# Altium schematic sheet Operations_Architecture.SchDoc
size Tabloid; SheetNumber: 5; SheetTotal: 13
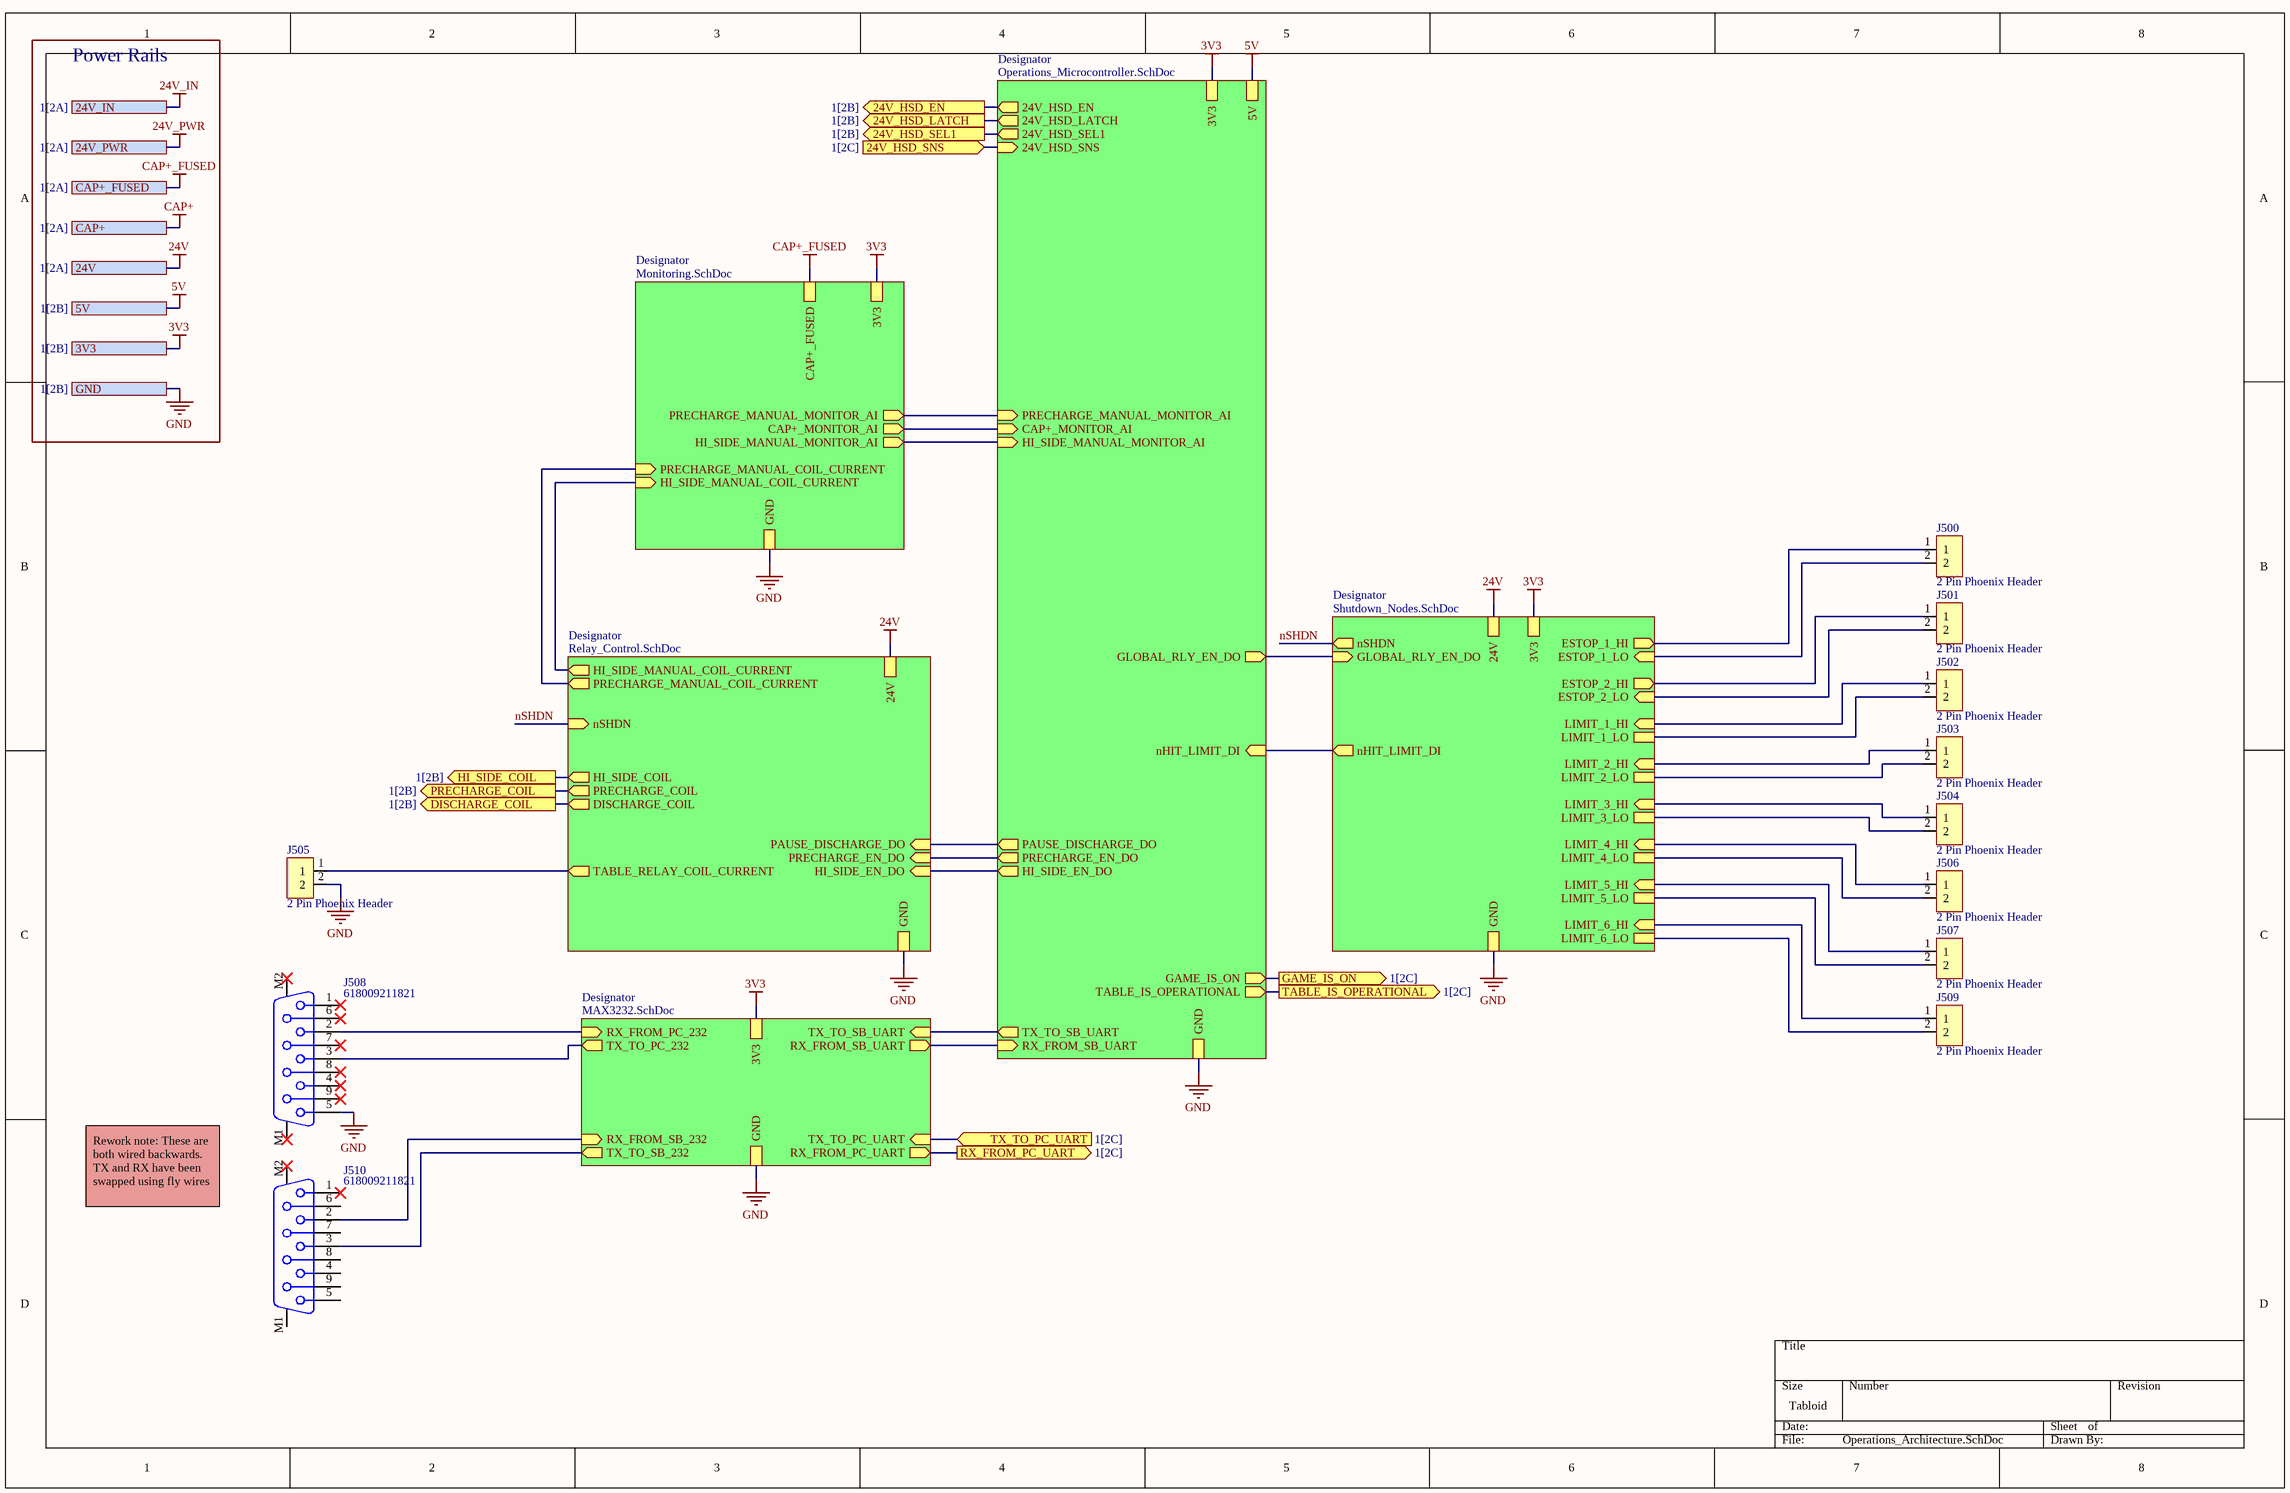
[diagram p0: Operations_Architecture.SchDoc]

## Parts
J500  2 Pin Phoenix Header  [2 Pin Phoenix Header]
J501  2 Pin Phoenix Header  [2 Pin Phoenix Header]
J502  2 Pin Phoenix Header  [2 Pin Phoenix Header]
J503  2 Pin Phoenix Header  [2 Pin Phoenix Header]
J504  2 Pin Phoenix Header  [2 Pin Phoenix Header]
J505  2 Pin Phoenix Header  [2 Pin Phoenix Header]
J506  2 Pin Phoenix Header  [2 Pin Phoenix Header]
J507  2 Pin Phoenix Header  [2 Pin Phoenix Header]
J508  618009211821  [618009211821]
J509  2 Pin Phoenix Header  [2 Pin Phoenix Header]
J510  618009211821  [618009211821]

## Sub-sheets
Designator = Relay_Control.SchDoc: nSHDN (in), TABLE_RELAY_COIL_CURRENT (out), 24V, GND, PRECHARGE_MANUAL_COIL_CURRENT (out), HI_SIDE_MANUAL_COIL_CURRENT (out), PAUSE_DISCHARGE_DO (in), PRECHARGE_EN_DO (in), HI_SIDE_EN_DO (in), DISCHARGE_COIL (out), HI_SIDE_COIL (out), PRECHARGE_COIL (out)
Designator = Monitoring.SchDoc: CAP+_MONITOR_AI (out), HI_SIDE_MANUAL_MONITOR_AI (out), PRECHARGE_MANUAL_MONITOR_AI (out), HI_SIDE_MANUAL_COIL_CURRENT (in), PRECHARGE_MANUAL_COIL_CURRENT (in), 3V3, GND, CAP+_FUSED
Designator = Shutdown_Nodes.SchDoc: ESTOP_1_HI (out), ESTOP_1_LO (in), ESTOP_2_HI (out), ESTOP_2_LO (in), nSHDN (out), LIMIT_1_HI (in), LIMIT_1_LO, LIMIT_2_HI (in), LIMIT_2_LO, LIMIT_3_HI (in), LIMIT_3_LO, LIMIT_4_HI (in), LIMIT_4_LO, LIMIT_5_HI (in), LIMIT_5_LO, LIMIT_6_HI (in), LIMIT_6_LO, nHIT_LIMIT_DI (out), GLOBAL_RLY_EN_DO (in), 24V, GND, 3V3
Designator = Operations_Microcontroller.SchDoc: PAUSE_DISCHARGE_DO (out), PRECHARGE_EN_DO (out), HI_SIDE_EN_DO (out), GLOBAL_RLY_EN_DO (out), nHIT_LIMIT_DI (in), TX_TO_SB_UART (out), RX_FROM_SB_UART (in), CAP+_MONITOR_AI (in), HI_SIDE_MANUAL_MONITOR_AI (in), PRECHARGE_MANUAL_MONITOR_AI (in), GAME_IS_ON (out), TABLE_IS_OPERATIONAL (out), 3V3, GND, 24V_HSD_EN (out), 24V_HSD_LATCH (out), 24V_HSD_SEL1 (out), 24V_HSD_SNS (in), 5V
Designator = MAX3232.SchDoc: TX_TO_PC_232 (out), RX_FROM_PC_232 (in), TX_TO_SB_232 (out), RX_FROM_SB_232 (in), 3V3, GND, TX_TO_SB_UART (in), RX_FROM_SB_UART (out), TX_TO_PC_UART (in), RX_FROM_PC_UART (out)

## Ports
3V3 (see 1[2B]), 5V (see 1[2B]), 24V (see 1[2A]), 24V_HSD_EN (out, see 1[2B]), 24V_HSD_LATCH (out, see 1[2B]), 24V_HSD_SEL1 (out, see 1[2B]), 24V_HSD_SNS (in, see 1[2C]), 24V_IN (see 1[2A]), 24V_PWR (see 1[2A]), CAP+ (see 1[2A]), CAP+_FUSED (see 1[2A]), DISCHARGE_COIL (out, see 1[2B]), GAME_IS_ON (out, see 1[2C]), GND (see 1[2B]), HI_SIDE_COIL (out, see 1[2B]), PRECHARGE_COIL (out, see 1[2B]), RX_FROM_PC_UART (out, see 1[2C]), TABLE_IS_OPERATIONAL (out, see 1[2C]), TX_TO_PC_UART (in, see 1[2C])

## Nets
3V3: port 3V3, sheet Designator/3V3, sheet Designator/3V3, sheet Designator/3V3, sheet Designator/3V3
5V: port 5V, sheet Designator/5V
24V: port 24V, sheet Designator/24V, sheet Designator/24V
24V_IN: port 24V_IN
24V_PWR: port 24V_PWR
CAP+: port CAP+
CAP+_FUSED: port CAP+_FUSED, sheet Designator/CAP+_FUSED
GND: J505.2 J508.5 ; port GND, sheet Designator/GND, sheet Designator/GND, sheet Designator/GND, sheet Designator/GND, sheet Designator/GND
24V_HSD_EN: port 24V_HSD_EN, sheet Designator/24V_HSD_EN
24V_HSD_LATCH: port 24V_HSD_LATCH, sheet Designator/24V_HSD_LATCH
24V_HSD_SEL1: port 24V_HSD_SEL1, sheet Designator/24V_HSD_SEL1
24V_HSD_SNS: port 24V_HSD_SNS, sheet Designator/24V_HSD_SNS
DISCHARGE_COIL: port DISCHARGE_COIL, sheet Designator/DISCHARGE_COIL
GAME_IS_ON: port GAME_IS_ON, sheet Designator/GAME_IS_ON
HI_SIDE_COIL: port HI_SIDE_COIL, sheet Designator/HI_SIDE_COIL
nSHDN: sheet Designator/nSHDN, sheet Designator/nSHDN
PRECHARGE_COIL: port PRECHARGE_COIL, sheet Designator/PRECHARGE_COIL
RX_FROM_PC_UART: port RX_FROM_PC_UART, sheet Designator/RX_FROM_PC_UART
TABLE_IS_OPERATIONAL: port TABLE_IS_OPERATIONAL, sheet Designator/TABLE_IS_OPERATIONAL
TX_TO_PC_UART: port TX_TO_PC_UART, sheet Designator/TX_TO_PC_UART
NetJ500_1: J500.1 ; sheet Designator/ESTOP_1_HI
NetJ500_2: J500.2 ; sheet Designator/ESTOP_1_LO
NetJ501_1: J501.1 ; sheet Designator/ESTOP_2_HI
NetJ501_2: J501.2 ; sheet Designator/ESTOP_2_LO
NetJ502_1: J502.1 ; sheet Designator/LIMIT_1_HI
NetJ502_2: J502.2 ; sheet Designator/LIMIT_1_LO
NetJ503_1: J503.1 ; sheet Designator/LIMIT_2_HI
NetJ503_2: J503.2 ; sheet Designator/LIMIT_2_LO
NetJ504_1: J504.1 ; sheet Designator/LIMIT_3_HI
NetJ504_2: J504.2 ; sheet Designator/LIMIT_3_LO
NetJ505_1: J505.1 ; sheet Designator/TABLE_RELAY_COIL_CURRENT
NetJ506_1: J506.1 ; sheet Designator/LIMIT_4_HI
NetJ506_2: J506.2 ; sheet Designator/LIMIT_4_LO
NetJ507_1: J507.1 ; sheet Designator/LIMIT_5_HI
NetJ507_2: J507.2 ; sheet Designator/LIMIT_5_LO
NetJ508_2: J508.2 ; sheet Designator/RX_FROM_PC_232
NetJ508_3: J508.3 ; sheet Designator/TX_TO_PC_232
NetJ509_1: J509.1 ; sheet Designator/LIMIT_6_HI
NetJ509_2: J509.2 ; sheet Designator/LIMIT_6_LO
NetJ510_2: J510.2 ; sheet Designator/RX_FROM_SB_232
NetJ510_3: J510.3 ; sheet Designator/TX_TO_SB_232
(unnamed): sheet Designator/PRECHARGE_MANUAL_COIL_CURRENT, sheet Designator/PRECHARGE_MANUAL_COIL_CURRENT
(unnamed): sheet Designator/HI_SIDE_MANUAL_COIL_CURRENT, sheet Designator/HI_SIDE_MANUAL_COIL_CURRENT
(unnamed): sheet Designator/PAUSE_DISCHARGE_DO, sheet Designator/PAUSE_DISCHARGE_DO
(unnamed): sheet Designator/PRECHARGE_EN_DO, sheet Designator/PRECHARGE_EN_DO
(unnamed): sheet Designator/HI_SIDE_EN_DO, sheet Designator/HI_SIDE_EN_DO
(unnamed): sheet Designator/CAP+_MONITOR_AI, sheet Designator/CAP+_MONITOR_AI
(unnamed): sheet Designator/HI_SIDE_MANUAL_MONITOR_AI, sheet Designator/HI_SIDE_MANUAL_MONITOR_AI
(unnamed): sheet Designator/PRECHARGE_MANUAL_MONITOR_AI, sheet Designator/PRECHARGE_MANUAL_MONITOR_AI
(unnamed): sheet Designator/nHIT_LIMIT_DI, sheet Designator/nHIT_LIMIT_DI
(unnamed): sheet Designator/GLOBAL_RLY_EN_DO, sheet Designator/GLOBAL_RLY_EN_DO
(unnamed): sheet Designator/TX_TO_SB_UART, sheet Designator/TX_TO_SB_UART
(unnamed): sheet Designator/RX_FROM_SB_UART, sheet Designator/RX_FROM_SB_UART

Not connected (* = marked no-connect by the designer): J508 1* 4* 6* 7* 8* 9* M1* M2*; J510 1* 4 5 6 7 8 9 M1 M2*

## Notes on the sheet
- Power Rails
- Rework note: These are both wired backwards. TX and RX have been swapped using fly wires

## Library data of the parts
J508 J510 = CMP-1502-00208-2: NexarPartId: 89205517; Gender: Female; Contact Resistance: 30mΩ; Insulation Resistance: 5GΩ; Current Rating: 3A; Operating Supply Voltage: 125V; Pitch: 2.77mm; Insulation Material: PBT; Contact Plating: Gold; Number of Pins: 9; RoHS: Compliant; Max Operating Temperature: 105°C; Length: 16.33mm; Min Operating Temperature: -55°C